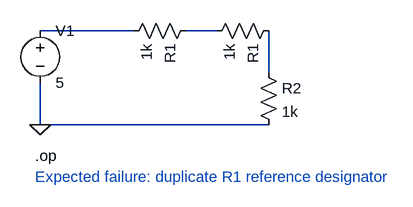
[diagram p0: schematic 10_error_duplicate_refdes.asc]
10_error_duplicate_refdes.asc, the LTspice schematic file:
Version 4
SHEET 1 880 680
WIRE 80 96 224 96
WIRE 304 96 352 96
WIRE 432 96 432 160
WIRE 80 176 80 240
WIRE 80 240 432 240
FLAG 80 240 0
SYMBOL voltage 80 80 R0
SYMATTR InstName V1
SYMATTR Value 5
SYMBOL res 320 80 R90
SYMATTR InstName R1
SYMATTR Value 1k
SYMBOL res 448 80 R90
SYMATTR InstName R1
SYMATTR Value 1k
SYMBOL res 416 144 R0
SYMATTR InstName R2
SYMATTR Value 1k
TEXT 72 288 Left 2 !.op
TEXT 72 320 Left 2 ;Expected failure: duplicate R1 reference designator

The netlist it stands for:
* 10_error_duplicate_refdes.asc
V1 N001 0 5
R1 N002 N001 1k
R1 N003 N002 1k
R2 N003 0 1k
.op
* Expected failure: duplicate R1 reference designator
.backanno
.end